# EAGLE design IR_Line8 (EAGLE 7.5.0)
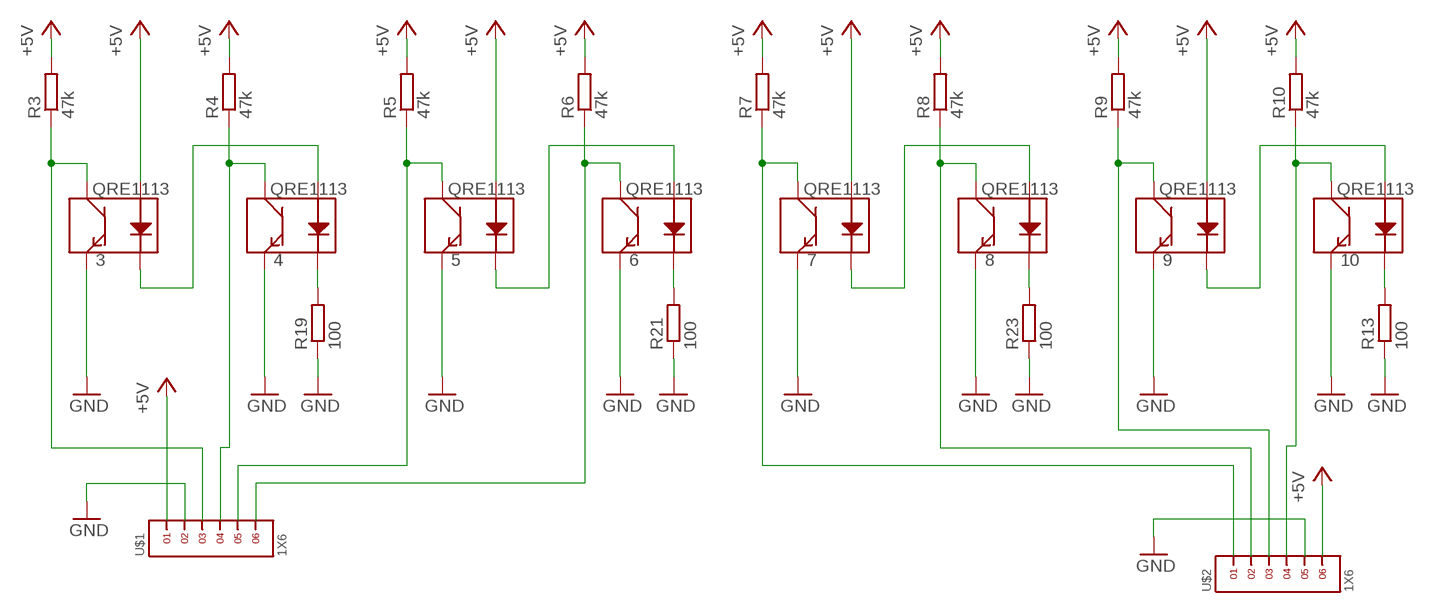
[diagram p0: schematic, sheet 1]

## Parts
3  QRE1113  [QRE1113]
4  QRE1113  [QRE1113]
5  QRE1113  [QRE1113]
6  QRE1113  [QRE1113]
7  QRE1113  [QRE1113]
8  QRE1113  [QRE1113]
9  QRE1113  [QRE1113]
10  QRE1113  [QRE1113]
R3  47k  R-EU_R0805  [R0805]
R4  47k  R-EU_R0805  [R0805]
R5  47k  R-EU_R0805  [R0805]
R6  47k  R-EU_R0805  [R0805]
R7  47k  R-EU_R0805  [R0805]
R8  47k  R-EU_R0805  [R0805]
R9  47k  R-EU_R0805  [R0805]
R10  47k  R-EU_R0805  [R0805]
R13  100  R-EU_R0805  [R0805]
R19  100  R-EU_R0805  [R0805]
R21  100  R-EU_R0805  [R0805]
R23  100  R-EU_R0805  [R0805]
U$1  1X6  [1X6]
U$2  1X6  [1X6]

## Nets
+5V: 3.1(A) 5.1(A) 7.1(A) 9.1(A) R3.2 R4.2 R5.2 R6.2 R7.2 R8.2 R9.2 R10.2 U$1.1 U$2.6
GND: 3.4(E) 4.4(E) 5.4(E) 6.4(E) 7.4(E) 8.4(E) 9.4(E) 10.4(E) R13.1 R19.1 R21.1 R23.1 U$1.2 U$2.5
N$2: 10.3(C) R10.1 U$2.4
N$4: 6.3(C) R6.1 U$1.6
N$5: 3.2(K) 4.1(A)
N$6: 5.3(C) R5.1 U$1.5
N$8: 4.3(C) R4.1 U$1.4
N$9: 3.3(C) R3.1 U$1.3
N$12: 5.2(K) 6.1(A)
N$13: 7.2(K) 8.1(A)
N$14: 4.2(K) R19.2
N$18: 9.3(C) R9.1 U$2.3
N$19: 10.2(K) R13.2
N$21: 9.2(K) 10.1(A)
N$23: 6.2(K) R21.2
N$26: 7.3(C) R7.1 U$2.1
N$27: 8.2(K) R23.2
N$29: 8.3(C) R8.1 U$2.2

## Library data of the parts
3-10 = QRE1113GR:QRE1113
R3-R10 R13 R19 R21 R23 = rcl:R-EU_: RESISTOR, European symbol
U$1 U$2 = pin:1X6

## Board
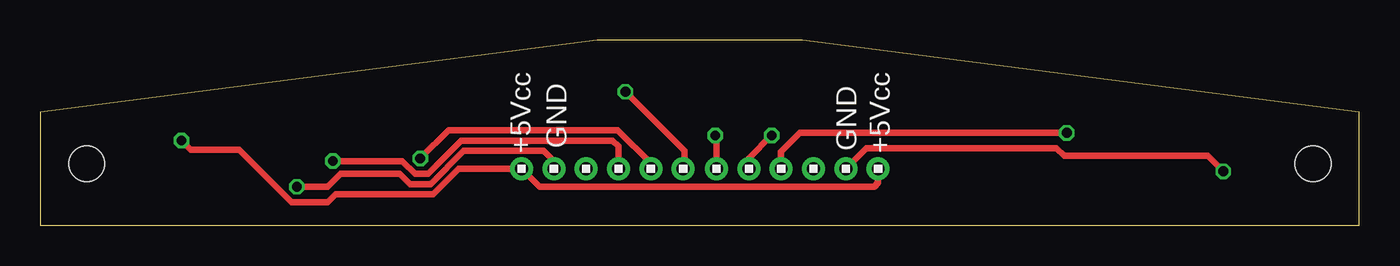
[diagram p1: board, top side]
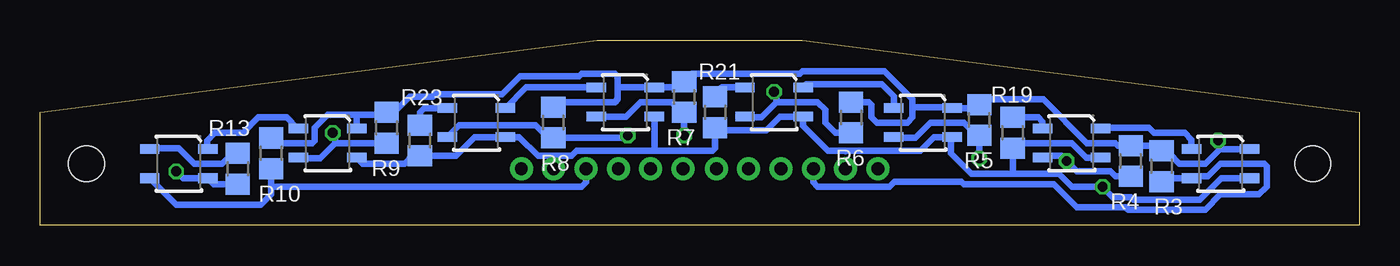
[diagram p2: board, bottom side, seen from below]

Size 81.58 x 11.43 mm. Coordinates in mm from the lower left corner, seen from the top.
Outline: 0,0 81.58,0 81.58,6.98 47.15,11.43 34.45,11.43 0,6.98 0,0
Copper layers (1*16): Top 0.0356mm / dielectric 1.5011mm / Bottom 0.0356mm
Design rules "LaenPCBOrder": minimum track width 6mil, minimum drill 13mil, track to track 6mil, track to pad 6mil, pad to pad 6mil, via to via 6mil, smd to smd 6mil, copper to edge 15mil, drill to drill 6mil, minimum pad ring 7mil, minimum via ring 7mil, stop-mask expansion 3mil, vias tented up to drill 0mil, thermal gap 10mil
Holes 2.2 mm at 2.86,3.81 78.74,3.81

### Footprints (pad centres in the part's own frame; a part is rotated, then mirrored left to right if it is on the bottom)
QRE1113 = smd 1.2 x 0.6: 1 -1.8,-0.9; 2 1.8,-0.9; 3 1.8,0.9; 4 -1.8,0.9
R0805 = smd 1.3 x 1.5: 1 -0.95,0; 2 0.95,0
1X6 = drill 0.8 pad 1.422: 1 -5,0; 2 -3,0; 3 -1,0; 4 1,0; 5 3,0; 6 5,0

### Placement (x,y rotation side)
3  8.57,3.81 180 bottom
4  17.78,5.08 180 bottom
5  26.99,6.35 180 bottom
6  36.2,7.62 180 bottom
7  45.4,7.62 180 bottom
8  54.61,6.35 180 bottom
9  63.82,5.08 180 bottom
10  73.02,3.81 180 bottom
R3  12.22,3.65 90 bottom
R4  14.13,3.97 90 bottom
R5  23.49,6.51 90 bottom
R6  31.43,6.67 90 bottom
R7  41.75,7.94 90 bottom
R8  49.85,6.35 90 bottom
R9  60.17,6.03 90 bottom
R10  67.31,4.45 90 bottom
R13  69.37,3.49 90 bottom
R19  21.43,5.72 90 bottom
R21  39.85,6.99 90 bottom
R23  58.1,5.24 90 bottom
U$1  34.77,3.49 0 top
U$2  46.83,3.49 0 top

### Tracks (layer width: path | path; a pad name or v marks a point on that pad's centre or on a via)
+5V  (via drill 0.6)
  Top 0.406: v8.73,5.24 9.29,4.68 12.3,4.68 15.56,1.43 17.78,1.43 18.26,1.91 24.29,1.91 25.88,3.49 U$1.1 30.88,2.38 51.59,2.38 51.83,2.62 U$2.6
  Bottom 0.406: R6.2 30.32,7.62 30.16,7.46 30.16,6.67 29.84,6.35 27.94,6.35 27.62,6.67 27.62,7.3 | 27.62,7.3 25.24,7.3 5.1 23.7,7.25 R5.2 23.17,7.78 19.53,7.78 16.83,5.08 15.08,5.08 14.92,4.92 R4.2 12.54,4.92 R3.2 12.07,4.45 11.75,4.45 11.11,3.81 9.53,3.81 8.63,4.71 | 27.62,7.3 27.62,7.78 29.37,9.53 34.45,9.53 34.61,9.37 41.27,9.37 R7.2 42.12,8.52 7.1 45.83,8.52 45.88,8.57 | R8.2 49.53,7.62 46.04,7.62 45.88,7.78 45.88,8.57 | 45.88,8.57 45.88,9.21 46.04,9.37 48.1,9.37 48.26,9.21 51.91,9.21 53.02,8.1 57.15,8.1 57.31,7.94 58.74,7.94 59.69,6.98 R9.2 60.32,6.83 61.91,6.83 | R10.2 67,5.08 64.77,5.08 64.61,5.24 64.61,6.03 63.82,6.83 61.91,6.83 | 6.72,4.76 3.1 8.63,4.71 | 8.63,4.71 8.63,5.13 v8.73,5.24 | 9.1 62.02,6.72 61.91,6.83
GND  (via drill 0.6)
  Top 0.406: v15.88,2.38 17.78,2.38 18.57,3.18 22.23,3.18 22.86,2.54 24.13,2.54 26.19,4.6 31.11,4.6 31.77,3.95 U$1.2 | v73.18,3.33 72.23,4.29 63.34,4.29 62.86,4.76 51.1,4.76 U$2.5
  Bottom 0.406: 4.4 16.88,4.18 17.78,5.08 21.12,5.08 R19.1 21.43,3.33 21.27,3.18 | 31.75,4.6 27.15,4.6 26.3,5.45 5.4 25.24,5.4 25.24,4.45 23.97,3.18 21.27,3.18 | 31.75,4.6 32.86,4.6 34.39,6.14 6.4 35.82,6.72 36.67,5.87 39.84,5.87 R21.1 39.85,4.76 40,4.6 43.5,4.6 | 9.4 61.65,3.81 59.05,3.81 58.58,4.29 R23.1 55.88,4.29 54.72,5.45 8.4 51.96,5.45 50.8,4.29 50.01,4.29 | 31.77,4.59 31.75,4.6 | 3.4 8.52,2.91 9.84,1.59 13.97,1.59 14.13,1.75 15.24,1.75 v15.88,2.38 17.78,2.38 18.57,3.18 21.27,3.18 | 50.01,4.29 48.74,4.29 48.42,4.6 43.5,4.6 | U$2.5 49.83,4.11 50.01,4.29 | 7.4 43.6,4.71 43.5,4.6 | R13.1 70.86,2.54 10.4 72.76,2.91 v73.18,3.33
N$2
  Bottom 0.406: R10.1 67.31,2.38 | 67.31,2.38 67.31,1.91 67.94,1.27 73.19,1.27 10.3 | U$2.4 47.83,2.65 48.1,2.38 67.31,2.38
N$4  (via drill 0.6)
  Top 0.406: v36.2,8.26 39.85,4.6 39.85,3.57 U$1.6
  Bottom 0.406: R6.1 32.39,5.72 33.02,6.35 33.02,7.14 33.5,7.62 36.04,7.62 | 36.04,7.62 36.99,6.67 37.94,6.67 6.3 | 36.04,7.62 36.04,8.1 v36.2,8.26
N$5
  Bottom 0.406: 3.2 10.37,5.29 10.79,5.72 12.7,5.72 13.02,6.03 15.93,6.03 4.1
N$6  (via drill 0.6)
  Top 0.406: U$1.5 37.77,3.83 35.72,5.87 25.24,5.87 v23.49,4.13
  Bottom 0.406: 5.3 28.73,5.4 27.46,5.4 26.51,6.35 24.45,6.35 23.66,5.56 R5.1 v23.49,4.13
N$8  (via drill 0.6)
  Top 0.406: v18.1,3.97 22.38,3.97 23.18,3.18 23.97,3.18 26.03,5.24 35.4,5.24 35.77,4.87 U$1.4
  Bottom 0.406: R4.1 15.08,3.02 15.4,3.33 17.46,3.33 v18.1,3.97 18.41,4.29 19.47,4.29 4.3
N$9
  Bottom 0.406: U$1.3 33.77,2.65 33.5,2.38 29.05,2.38 28.73,2.7 24.61,2.7 24.45,2.54 18.89,2.54 17.46,1.11 14.45,1.11 14.29,0.95 9.53,0.95 8.57,1.91 6.19,1.91 5.72,2.38 5.72,3.65 5.87,3.81 8.57,3.81 9.37,3.02 10.27,3.02 3.3 12.01,2.91 R3.1
N$12
  Bottom 0.406: 5.2 28.79,7.99 29.53,8.73 34.18,8.73 6.1
N$13
  Bottom 0.406: 7.2 51.54,8.52 8.1
N$14
  Bottom 0.406: 4.2 19.58,6.4 19.84,6.67 R19.2
N$18  (via drill 0.6)
  Top 0.406: U$2.3 45.83,4.56 46.99,5.72 v63.5,5.72
  Bottom 0.406: R9.1 63.34,5.08 | 63.34,5.08 64.29,4.13 65.56,4.13 9.3 | 63.34,5.08 63.34,5.24 v63.5,5.72
N$19
  Bottom 0.406: R13.2 69.69,4.44 70.33,3.81 72.07,3.81 73.02,4.76 74.77,4.76 10.2
N$21
  Bottom 0.406: 9.2 65.67,5.98 66.36,6.67 68.1,6.67 69.06,5.72 70.8,5.72 71.28,5.24 71.28,4.76 10.1
N$23
  Bottom 0.406: 6.2 39.42,8.52 R21.2
N$26  (via drill 0.6)
  Top 0.406: U$2.1 41.83,5.48 v41.75,5.56
  Bottom 0.406: 7.3 45.35,6.72 44.45,7.62 42.55,7.62 41.91,6.99 R7.1 v41.75,5.56
N$27
  Bottom 0.406: 8.2 57.84,7.25 58.1,6.99 R23.2
N$29  (via drill 0.6)
  Top 0.406: U$2.2 43.83,4.14 v45.24,5.56
  Bottom 0.406: 8.3 55.67,6.19 50.96,6.19 50.17,5.4 R8.1 45.56,5.4 v45.24,5.56

### Text on the board
tNames: GND | GND | +5Vcc | +5Vcc